# Altium schematic sheet Audio.SchDoc: Audio
size A4; DocumentNumber: MB1246; Revision: B.1; SheetNumber: 5; SheetTotal: 17; Project: STM32H7xxI-EVAL
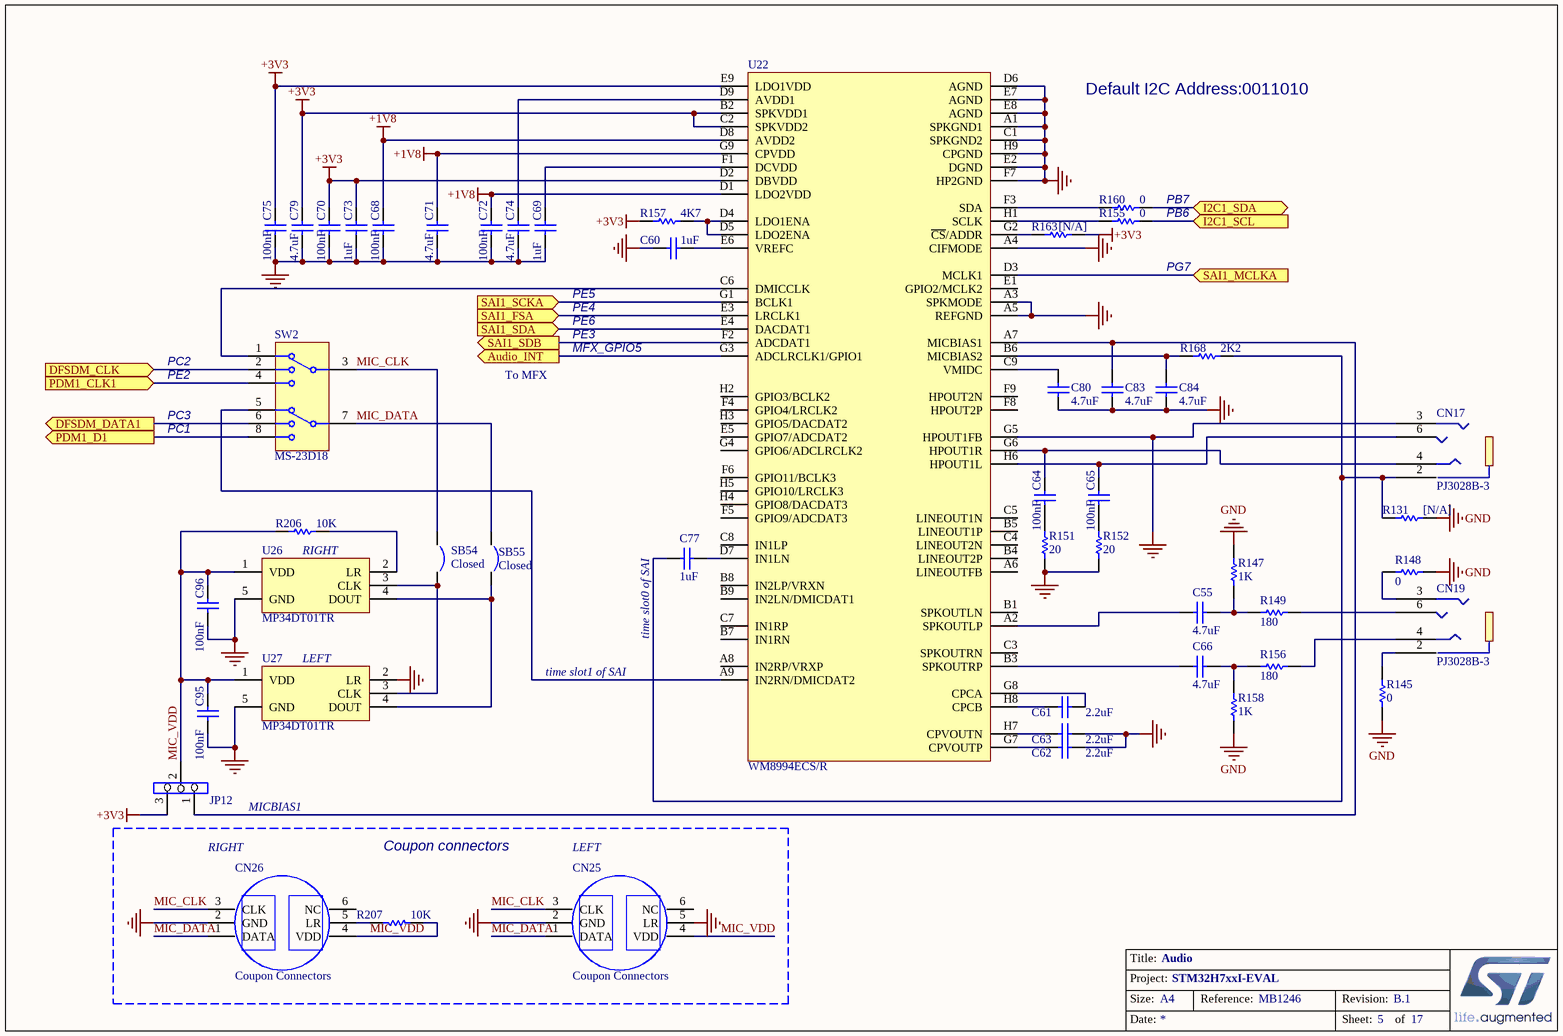
[diagram p0: Audio.SchDoc]

## Parts
C55  4.7uF  [0603C]
C60  1uF  [0603C]
C61  2.2uF  [0603C]
C62  2.2uF  [0603C]
C63  2.2uF  [0603C]
C64  100nF  [0603C]
C65  100nF  [0603C]
C66  4.7uF  [0603C]
C68  100nF  [0603C]
C69  1uF  [0603C]
C70  100nF  [0603C]
C71  4.7uF  [0603C]
C72  100nF  [0603C]
C73  1uF  [0603C]
C74  4.7uF  [0603C]
C75  100nF  [0603C]
C77  1uF  [0603C]
C79  4.7uF  [0603C]
C80  4.7uF  [0603C]
C83  4.7uF  [0603C]
C84  4.7uF  [0603C]
C95  100nF  [0603C]
C96  100nF  [0603C]
CN17  PJ3028B-3  [PJ3028B]
CN19  PJ3028B-3  [PJ3028B]
CN25  Coupon Connectors  [Coupon]
CN26  Coupon Connectors  [Coupon]
JP12  (no value)  [SIP3]
R131  [N/A]  [0603R]
R145  0  [0603R]
R147  1K  [0402R]
R148  0  [0603R]
R149  180  [0402R]
R151  20  [0603R]
R152  20  [0603R]
R155  0  [0603R]
R156  180  [0402R]
R157  4K7  [0603R]
R158  1K  [0402R]
R160  0  [0603R]
R163  [N/A]  [0603R]
R168  2K2  [0603R]
R206  10K  [0603R]
R207  10K  [0603R]
SB54  Closed  [SB_0603]
SB55  Closed  [SB_0603]
SW2  MS-23D18  [SW1_8TH_13X3R5]
U22  WM8994ECS/R  [BGA72_0R5_4R5X4]
U26  MP34DT01TR  [MP34DT01TR]
U27  MP34DT01TR  [MP34DT01TR]

## Blocks framed on the sheet
Coupon connectors: CN25 CN26 R207

## Ports
Audio_INT (out), DFSDM_CLK (in), DFSDM_DATA1 (out), I2C1_SCL (in), I2C1_SDA (bidir), PDM1_CLK1 (in), PDM1_D1 (out), SAI1_FSA (in), SAI1_MCLKA (in), SAI1_SCKA (in), SAI1_SDA (in), SAI1_SDB (out)

## Nets
+1V8: C68.1 C71.1 C72.1 U22.D1(LDO2VDD) U22.D8(AVDD2) U22.G9(CPVDD)
+3V3: C70.1 C73.1 C75.1 C79.1 JP12.3 R157.2 R163.1 U22.B2(SPKVDD1) U22.C2(SPKVDD2) U22.D2(DBVDD) U22.E9(LDO1VDD)
GND: C60.2 C62.2 C63.2 C68.2 C69.2 C70.2 C71.2 C72.2 C73.2 C74.2 C75.2 C79.2 C80.1 C83.1 C84.1 C95.2 C96.2 CN17.3 CN25.2(GND) CN25.5(LR) CN26.2(GND) R131.1 R145.2 R147.2 R148.2 R151.2 R152.2 R158.1 U22.A1(SPKGND1) U22.A3(SPKMODE) U22.A4(CIFMODE) U22.A5(REFGND) U22.C1(SPKGND2) U22.D6(AGND) U22.E2(DGND) U22.E7(AGND) U22.E8(AGND) U22.F7(HP2GND) U22.G5(HPOUT1FB) U22.H9(CPGND) U26.5(GND) U27.2(LR) U27.5(GND)
Audio_INT: U22.G3(ADCLRCLK1/GPIO1) ; port Audio_INT
DFSDM_CLK: SW2.2 ; port DFSDM_CLK
DFSDM_DATA1: SW2.6 ; port DFSDM_DATA1
I2C1_SCL: R155.1 ; port I2C1_SCL
I2C1_SDA: R160.1 ; port I2C1_SDA
MIC_CLK: CN25.3(CLK) CN26.3(CLK) SB54.1 SW2.3
MIC_DATA: CN25.1(DATA) CN26.1(DATA) SB55.1 SW2.7
MIC_VDD: C95.1 C96.1 CN25.4(VDD) CN26.4(VDD) JP12.2 R206.2 R207.2 U26.1(VDD) U27.1(VDD)
PDM1_CLK1: SW2.4 ; port PDM1_CLK1
PDM1_D1: SW2.8 ; port PDM1_D1
SAI1_FSA: U22.E3(LRCLK1) ; port SAI1_FSA
SAI1_MCLKA: U22.D3(MCLK1) ; port SAI1_MCLKA
SAI1_SCKA: U22.G1(BCLK1) ; port SAI1_SCKA
SAI1_SDA: U22.E4(DACDAT1) ; port SAI1_SDA
SAI1_SDB: U22.F2(ADCDAT1) ; port SAI1_SDB
NetC55_1: C55.1 R147.1 R149.1
NetC55_2: C55.2 U22.A2(SPKOUTLP)
NetC60_1: C60.1 U22.E6(VREFC)
NetC61_1: C61.1 U22.H8(CPCB)
NetC61_2: C61.2 U22.G8(CPCA)
NetC62_1: C62.1 U22.G7(CPVOUTP)
NetC63_1: C63.1 U22.H7(CPVOUTN)
NetC64_1: C64.1 CN17.4 U22.G6(HPOUT1R)
NetC64_2: C64.2 R151.1
NetC65_1: C65.1 CN17.6 U22.H6(HPOUT1L)
NetC65_2: C65.2 R152.1
NetC66_1: C66.1 R156.2 R158.2
NetC66_2: C66.2 U22.B3(SPKOUTRP)
NetC69_1: C69.1 U22.F1(DCVDD)
NetC74_1: C74.1 U22.D9(AVDD1)
NetC77_1: C77.1 U22.D7(IN1LN)
NetC77_2: C77.2 CN17.2 R131.2 R168.1
NetC80_2: C80.2 U22.C9(VMIDC)
NetC83_2: C83.2 JP12.1 U22.A7(MICBIAS1)
NetC84_2: C84.2 R168.2 U22.B6(MICBIAS2)
NetCN19_2: CN19.2 R145.1
NetCN19_3: CN19.3 R148.1
NetCN19_4: CN19.4 R156.1
NetCN19_6: CN19.6 R149.2
NetCN26_5: CN26.5(LR) R207.1
NetR155_2: R155.2 U22.H1(SCLK)
NetR157_1: R157.1 U22.D4(LDO1ENA) U22.D5(LDO2ENA)
NetR160_2: R160.2 U22.F3(SDA)
NetR163_2: R163.2 U22.G2(~{CS}/ADDR)
NetR206_1: R206.1 U26.2(LR)
NetSB54_2: SB54.2 U26.3(CLK) U27.3(CLK)
NetSB55_2: SB55.2 U26.4(DOUT) U27.4(DOUT)
NetSW2_1: SW2.1 U22.C6(DMICCLK)
NetSW2_5: SW2.5 U22.A9(IN2RN/DMICDAT2)

Not connected (* = marked no-connect by the designer): CN25 6(NC); CN26 6(NC); U22 A6(LINEOUTFB) A8(IN2RP/VRXP) B1(SPKOUTLN) B4(LINEOUT2P) B5(LINEOUT1P) B7(IN1RN) B8(IN2LP/VRXN) B9(IN2LN/DMICDAT1) C3(SPKOUTRN) C4(LINEOUT2N) C5(LINEOUT1N) C7(IN1RP) C8(IN1LP) E1(GPIO2/MCLK2) E5(GPIO7/ADCDAT2) F4(GPIO4/LRCLK2) F5(GPIO9/ADCDAT3) F6(GPIO11/BCLK3) F8(HPOUT2P) F9(HPOUT2N) G4(GPIO6/ADCLRCLK2) H2(GPIO3/BCLK2) H3(GPIO5/DACDAT2) H4(GPIO8/DACDAT3) H5(GPIO10/LRCLK3)

## Notes on the sheet
- Default I2C Address:0011010
- PB7
- PB6
- PE5
- PE4
- PG7
- PC2
- PE2
- To MFX
- PE6
- PE3
- MFX_GPIO5
- PC3
- PC1
- RIGHT
- (near C77) time slot0 of SAI
- (near U27) LEFT
- time slot1 of SAI
- MICBIAS1
- LEFT
- Title:
- Project:
- Size:
- Date:
- A4
- Reference:
- Sheet:
- Revision:
- of

## Library data of the parts
C55 C66 = Cap: Capacitor; Value: 10nF; Ordered by: Subcon; Published: 8-Jun-2000; Revision: July-2002: Re-released for DXP Platform.; Publisher: Altium Limited
C60-C63 C69 C73 C77 = CAP: Capacitor; Value: 100nF; Published: 8-Jun-2000; Revision: July-2002: Re-released for DXP Platform.; Publisher: Altium Limited
C64 C65 C68 C70-C72 C74 C75 C79 C80 C83 C84 C95 C96 = Cap: Capacitor; Value: 10nF; Published: 8-Jun-2000; Revision: July-2002: Re-released for DXP Platform.; Publisher: Altium Limited
CN25 CN26 = Coupon Connectors: Header, 3-Pin, Single row; Revision: 17-Jul-2002: Re-released for DXP Platform.; Publisher: Altium Limited
JP12 = Jumper3
R131 R151 R152 R155 R157 R160 R163 R168 R206 R207 = Res1: Resistor; Value: 1K; Published: 8-Jun-2000; Revision: July-2002: Re-released for DXP Platform.; Publisher: Altium Limited
R145 R148 R149 R156 = Res1: Resistor; Value: 1K; Ordered by: Subcon; Published: 8-Jun-2000; Revision: July-2002: Re-released for DXP Platform.; Publisher: Altium Limited
R147 R158 = Res1: Resistor; Ordered by: Subcon; Published: 8-Jun-2000; Revision: July-2002: Re-released for DXP Platform.; Publisher: Altium Limited; Value: 1K
SB54 SB55 = Circuit Breaker_close: Circuit Breaker; Published: 24-Mar-1999; Revision: July-2002: Re-released for DXP Platform.; Publisher: Altium Limited
SW2 = MS-23D18: DPDT; Revision 1: Jul-2002: Re-released for DXP Platform.; Revision 2: 17-Dec-2003: Schematic revised, PCB Footprint replaced.; Published: 24-Mar-1999; Datasheet: Latest Revision: 05-Dec-2000; Publisher: Altium Limited
U26 U27 = MP34DT01TR: MEMS audio sensor; Revision: 17-Jul-2002: Re-released for DXP Platform.; Publisher: Altium Limited